# EAGLE schematic node-mcu-pack (EAGLE 7.5.0)
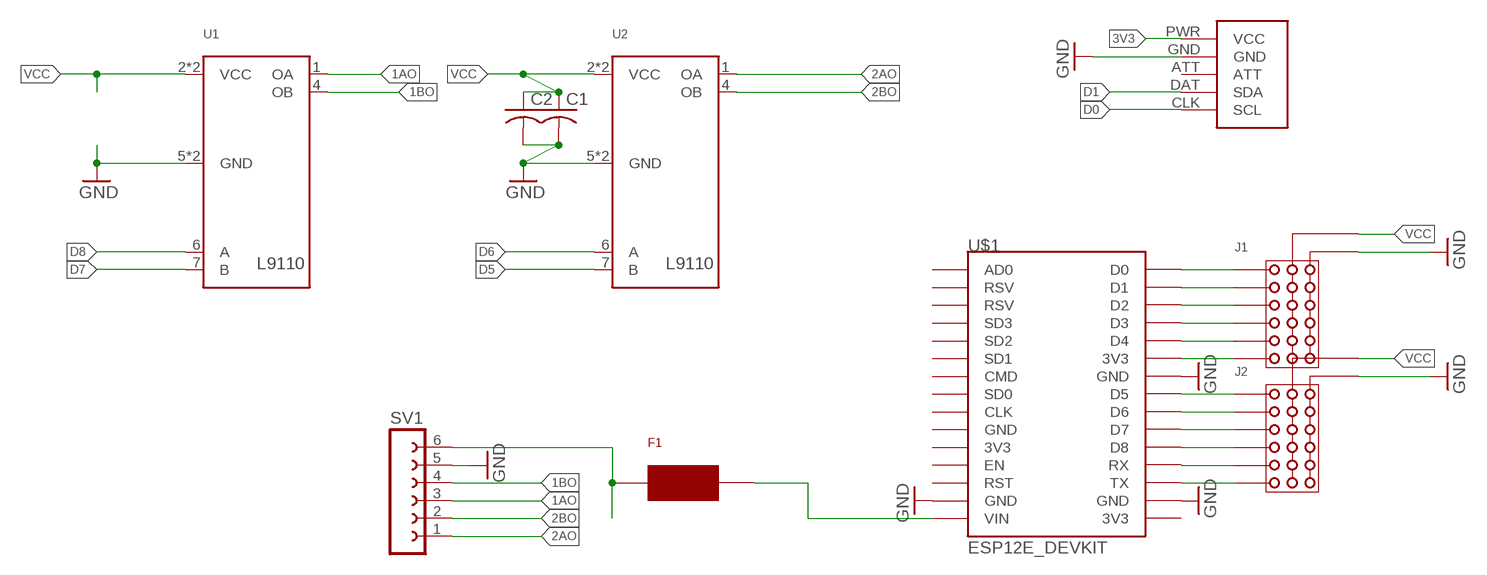
[diagram p0: schematic, sheet 1]

## Parts
C1  C-USC0805  [C0805]
C2  C-USC0805  [C0805]
F1  0154  [0154]
J1  IOBLOCK6  [IOBLOCK100MILX6]
J2  IOBLOCK6  [IOBLOCK100MILX6]
SV1  FE06-1  [FE06]
U1  L9110SMT  [8S1]
U2  L9110SMT  [8S1]
U$1  ESP12E_DEVKIT  [ESP12E_DEVKIT]
U$2  WIICHUCKOUTIE  [CHUCK-OUTIE]

## Nets
1AO: SV1.3 U1.1(OA)
1BO: SV1.4 U1.4(OB)
2AO: SV1.1 U2.1(OA)
2BO: SV1.2 U2.4(OB)
3V3: J1.P$6 U$1.3V3@1(3V3) U$2.PWR(VCC)
D0: J1.P$1 U$1.D0 U$2.CLK(SCL)
D1: J1.P$2 U$1.D1 U$2.DAT(SDA)
D5: J2.P$1 U2.7(B) U$1.D5
D6: J2.P$2 U2.6(A) U$1.D6
D7: J2.P$3 U1.7(B) U$1.D7
D8: J2.P$4 U1.6(A) U$1.D8
GND: C1.2 C2.2 J1.G1 J1.G2 J1.G3 J1.G4 J1.G5 J1.G6 J2.G1 J2.G2 J2.G3 J2.G4 J2.G5 J2.G6 SV1.5 U1.5(GND) U1.8(GND) U2.5(GND) U2.8(GND) U$1.GND@1(GND) U$1.GND@2(GND) U$1.GND@3(GND) U$2.GND
N$1: F1.1 SV1.6
N$4: J2.P$6 U$1.TX
N$5: J2.P$5 U$1.RX
N$11: J1.P$5 U$1.D4
N$12: J1.P$4 U$1.D3
N$13: J1.P$3 U$1.D2
VCC: C1.1 C2.1 F1.2 J1.P1 J1.P2 J1.P3 J1.P4 J1.P5 J1.P6 J2.P1 J2.P2 J2.P3 J2.P4 J2.P5 J2.P6 U1.2(VCC) U1.3(VCC) U2.2(VCC) U2.3(VCC) U$1.VIN
Unconnected: U$1.3V3@0(3V3) U$1.3V3@2(3V3) U$1.AD0 U$1.CLK U$1.CMD U$1.EN U$1.GND@0(GND) U$1.RST U$1.RSV@0(RSV) U$1.RSV@1(RSV) U$1.SD0 U$1.SD1 U$1.SD2 U$1.SD3 U$2.ATT

## Library data of the parts
C1 C2 = adafruit:C-US: CAPACITOR, American symbol
F1 = SMT_Fuse_0154001:0154
J1 J2 = ioblock:IOBLOCK6
SV1 = con-lsta:FE06-1: FEMALE HEADER; OC_FARNELL: unknown; OC_NEWARK: unknown
U1 U2 = L9110h:L9110
U$1 = ESP12E_DEVKIT:ESP12E_DEVKIT: ESP12E DEVKIT BOARD
U$2 = wiichuck:WIICHUCK